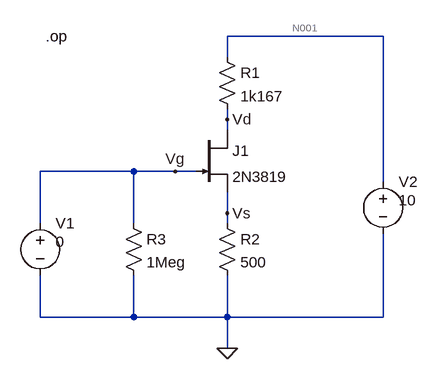
[diagram p0: schematic Activity 5.asc]
Activity 5.asc, the LTspice schematic file:
Version 4
SHEET 1 880 680
WIRE 672 -80 432 -80
WIRE 432 -48 432 -80
WIRE 432 48 432 32
WIRE 432 64 432 48
WIRE 288 128 144 128
WIRE 352 128 288 128
WIRE 384 128 352 128
WIRE 672 144 672 -80
WIRE 432 192 432 160
WIRE 144 208 144 128
WIRE 288 208 288 128
WIRE 432 208 432 192
WIRE 144 352 144 288
WIRE 288 352 288 288
WIRE 288 352 144 352
WIRE 432 352 432 288
WIRE 432 352 288 352
WIRE 672 352 672 224
WIRE 672 352 432 352
WIRE 432 400 432 352
FLAG 432 400 0
FLAG 432 48 Vd
FLAG 432 192 Vs
FLAG 352 128 Vg
SYMBOL voltage 672 128 R0
WINDOW 123 0 0 Left 0
WINDOW 39 0 0 Left 0
WINDOW 3 24 44 Left 2
SYMATTR InstName V2
SYMATTR Value 10
SYMBOL njf 384 64 R0
SYMATTR InstName J1
SYMATTR Value 2N3819
SYMBOL voltage 144 192 R0
WINDOW 123 0 0 Left 0
WINDOW 39 24 124 Left 2
WINDOW 3 24 44 Left 2
SYMATTR InstName V1
SYMATTR Value 0
SYMBOL res 416 -64 R0
SYMATTR InstName R1
SYMATTR Value 1k167
SYMBOL res 416 192 R0
SYMATTR InstName R2
SYMATTR Value 500
SYMBOL res 272 192 R0
SYMATTR InstName R3
SYMATTR Value 1Meg
TEXT 152 -80 Left 2 !.op

The netlist it stands for:
* Activity 5.asc
V2 N001 0 10
J1 Vd Vg Vs 2N3819
V1 Vg 0 0
R1 N001 Vd 1k167
R2 Vs 0 500
R3 Vg 0 1Meg
.model NJF NJF
.model PJF PJF
.lib standard.jft
.op
.backanno
.end

* Results of the author's LTspice run, read from the files saved beside the schematic
* Operating Point:
*   V(n001) = 10 V
*   V(vd) = 6.516 V
*   V(vg) = 0 V
*   V(vs) = 1.493 V
*   Id(J1) = 2.985 mA
*   Ig(J1) = -9.195 pA
*   Is(J1) = -2.985 mA
*   I(R3) = 0 A
*   I(R2) = 2.985 mA
*   I(R1) = 2.985 mA
*   I(V1) = 9.195 pA
*   I(V2) = -2.985 mA
* From the log:
*   Semiconductor Device Operating Points:
*                           --- JFET Transistors ---
*   Name:      j1
*   Model:   2n3819
*   Id:       2.99e-3
*   Vgs:     -1.49e+0
*   Vds:      5.02e+0
*   Gm:       3.97e-3
*   Gds:      6.64e-6
*   Cgs:       NaN
*   Cgd:       NaN